# EAGLE design SSR_Board (EAGLE 7.6.0)
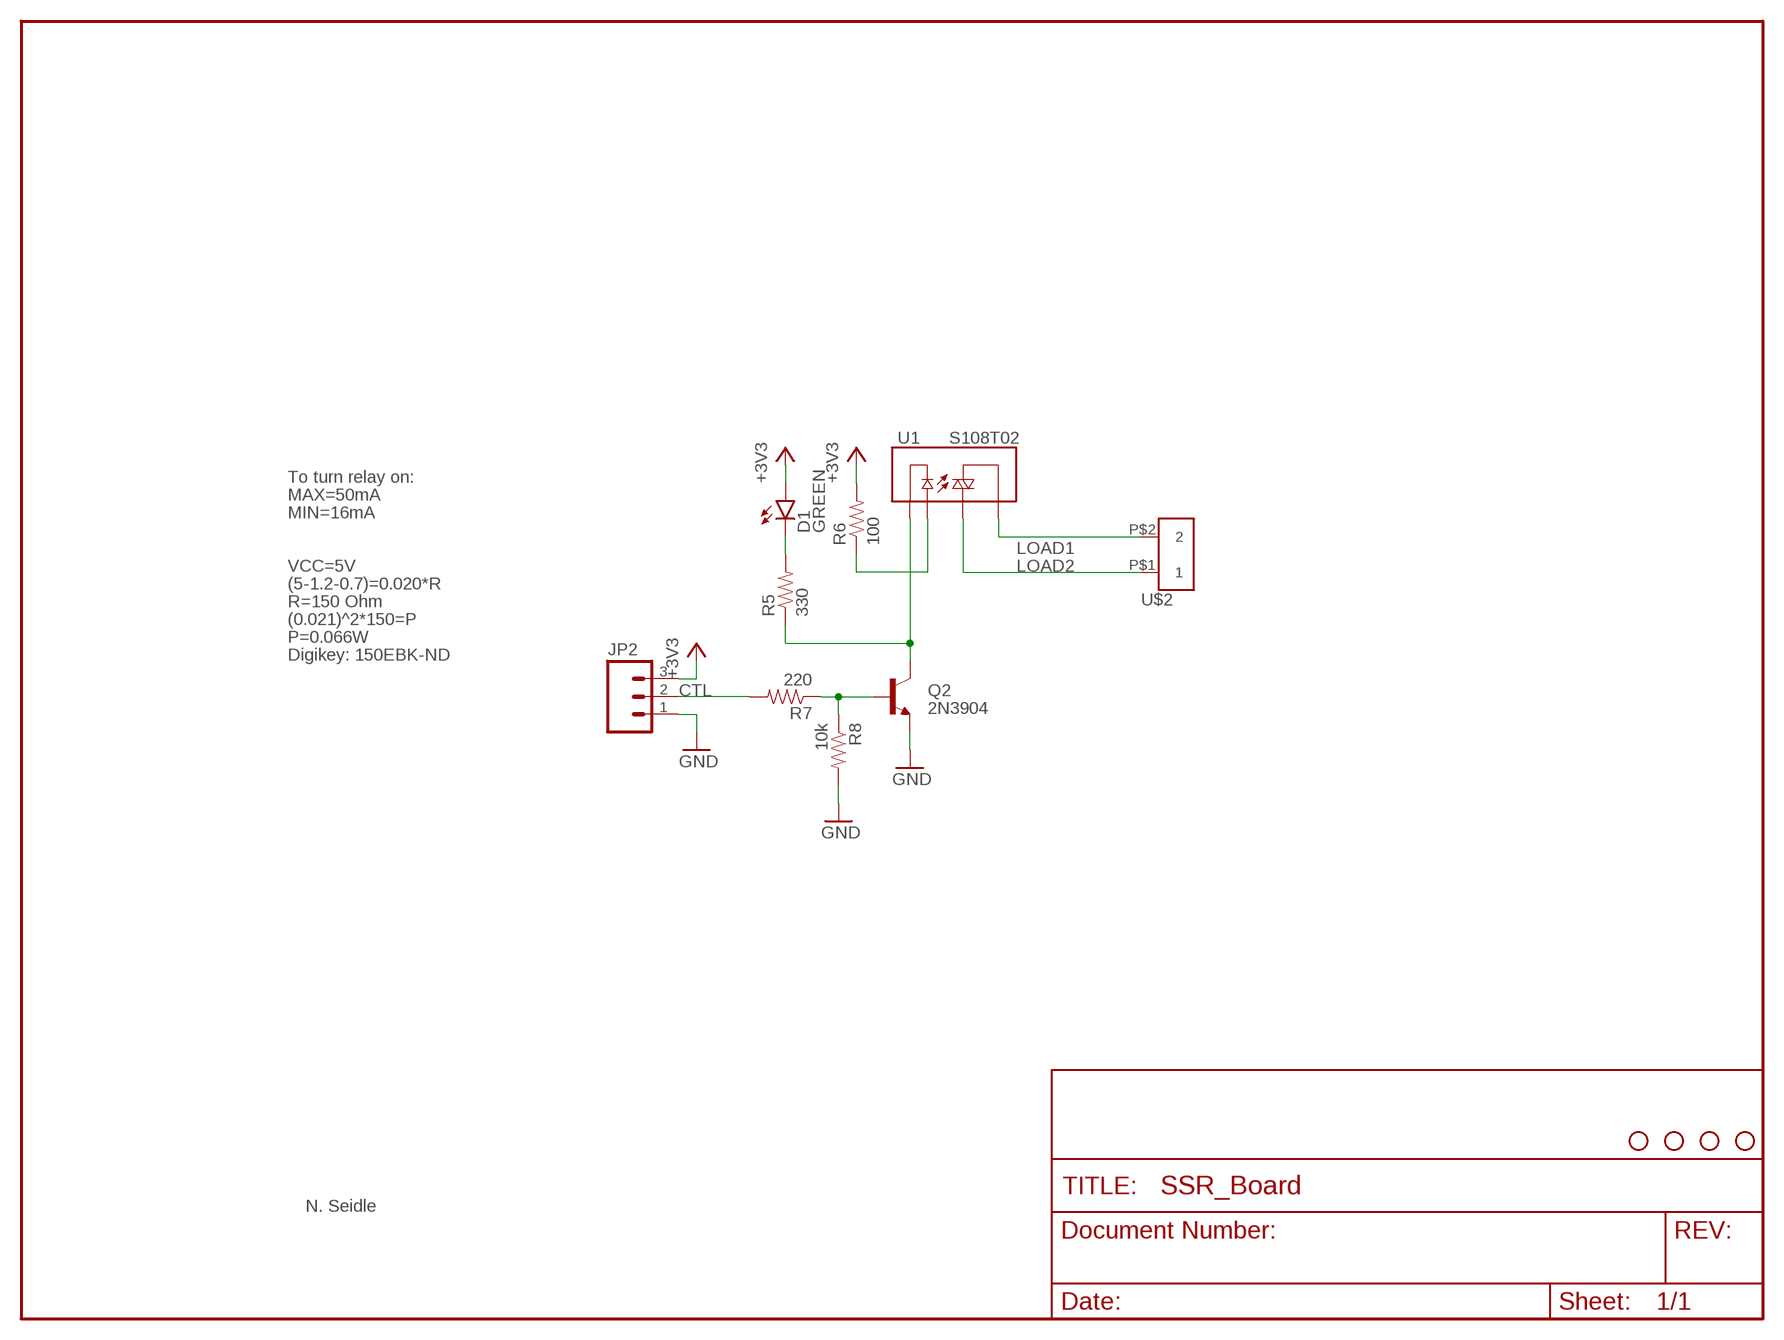
[diagram p0: schematic, sheet 1]

## Parts
D1  GREEN  LED-GREEN0603  [LED-0603]
JP2  M03SCREW  [SCREWTERMINAL-3.5MM-3]
Q2  2N3904  TRANSISTOR_NPNSOT23-3  [SOT23-3]
R5  330  RESISTOR0603-RES  [0603-RES]
R6  100  RESISTOR0603-RES  [0603-RES]
R7  220  RESISTOR0603-RES  [0603-RES]
R8  10k  RESISTOR0603-RES  [0603-RES]
U1  S108T02  RELAY-SOLIDSTATEPTH  [RELAY-S108T02]
U$2  6PCV-02-006  [6PCV-02-006]
U$3  STAND-OFF  [STAND-OFF]
U$4  STAND-OFF  [STAND-OFF]
U$5  STAND-OFF  [STAND-OFF]
U$7  STAND-OFF  [STAND-OFF]

## Nets
+3V3: D1.A JP2.3 R6.2
COIL: Q2.3(C) R5.1 U1.4(-)
CTL: JP2.2 R7.2
GND: JP2.1 Q2.2(E) R8.2
LOAD1: U1.1(T1) U$2.P$2
LOAD2: U1.2(T2) U$2.P$1
N$1: R6.1 U1.3(+)
N$6: Q2.1(B) R7.1 R8.1
N$9: D1.C R5.2

## Notes on the sheet
- To turn relay on:
- MAX=50mA
- MIN=16mA
- VCC=5V
- (5-1.2-0.7)=0.020*R
- R=150 Ohm
- (0.021)^2*150=P
- P=0.066W
- Digikey: 150EBK-ND
- N. Seidle

## Library data of the parts
D1 = SparkFun-LED:LED-GREEN: Various green LEDs Green LEDs used in SFE Production 0603- DIO-00821 LARGE- DIO-00862 LILYPAD- DIO-09910; PROD_ID: DIO-00821
JP2 = SparkFun:M03: Header 3 Standard 3-pin 0.1" header. Use with straight break away headers (SKU : PRT-00116), right angle break away headers (PRT-00553), swiss pins (PRT-00743), machine pins (PRT-00117), and female headers (PRT-00115). Molex polarized connector foot print use with SKU : PRT-08232 with associated crimp pins and housings.
Q2 = SparkFun-DiscreteSemi:TRANSISTOR_NPN: Generic NPN BJT MMBT2222A - TRANS-08049 (SOT-23, 1A 40V) MPSA42 - TRANS-09116 (SOT-23, 500mA 300V) MMBT5088LT1G - TRANS-11160 (SOT-23, 50 mA 30V) BC547 - COM-08928 <http://www.sparkfun.com/products/8928> (TO-92 45V 100mA) (1.Collector 2.Base 3.Emitter) 2N3904 - COM-00521 <http://www.sparkfun.com/products/521> (TO-92 40V 200mA) (1.Emitter 2.Base 3.Collector) P2N2222A - COM-12852 <http://www.sparkfun.com/products/12852> (TO-92 40V 600mA) (1.Collector 2.Base 3.Emitter); PROD_ID: TRANS-08049
R5-R8 = SparkFun-Passives:RESISTOR: Resistor Basic schematic elements and footprints for 0603, 1206, and PTH resistors.
U1 = SparkFun:RELAY-SOLIDSTATE
U$2 = Tim:6PCV-02-006: TE-Connectivity-AMP-Connectors Screw Block Terminal 6PCV-02-006 Digikey part number A98481-ND
U$3-U$5 U$7 = SparkFun:STAND-OFF: Stand Off This is the mechanical footprint for a #4 phillips button head screw. Use the keepout ring to avoid running the screw head into surrounding components. SKU : PRT-00447

## Board
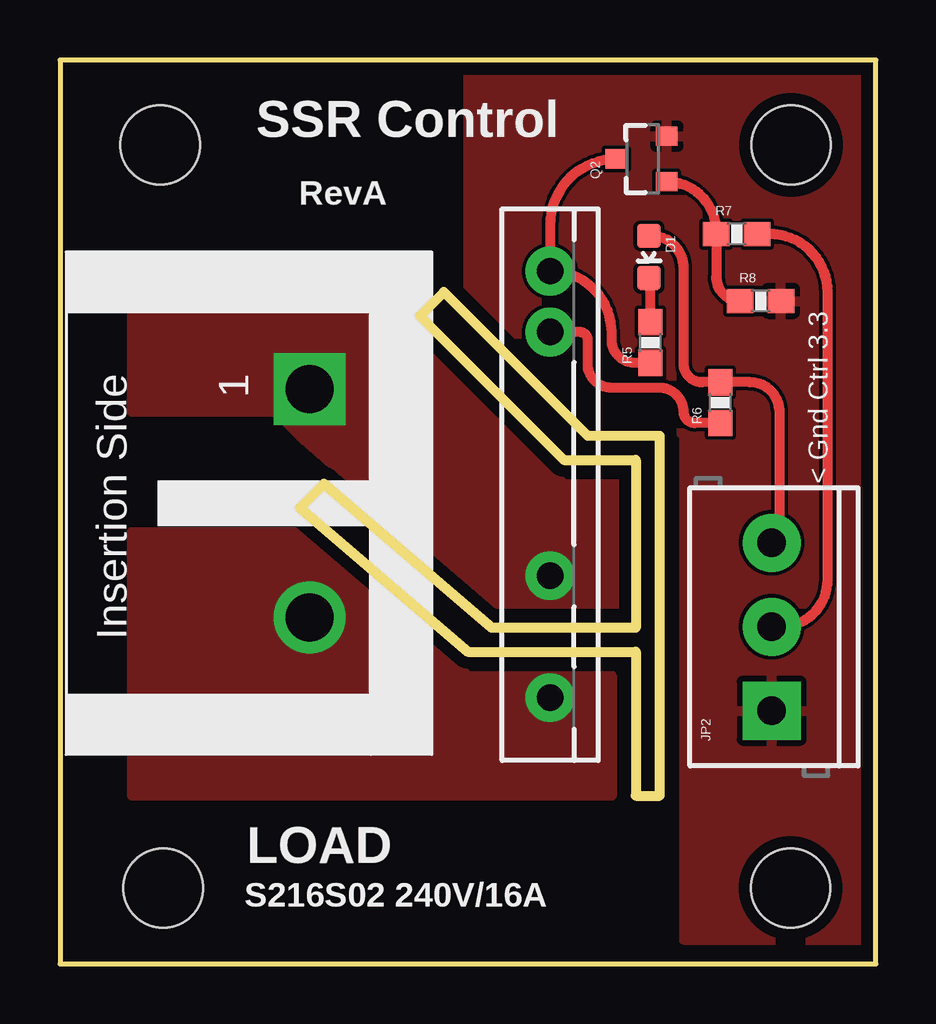
[diagram p1: board, top side]
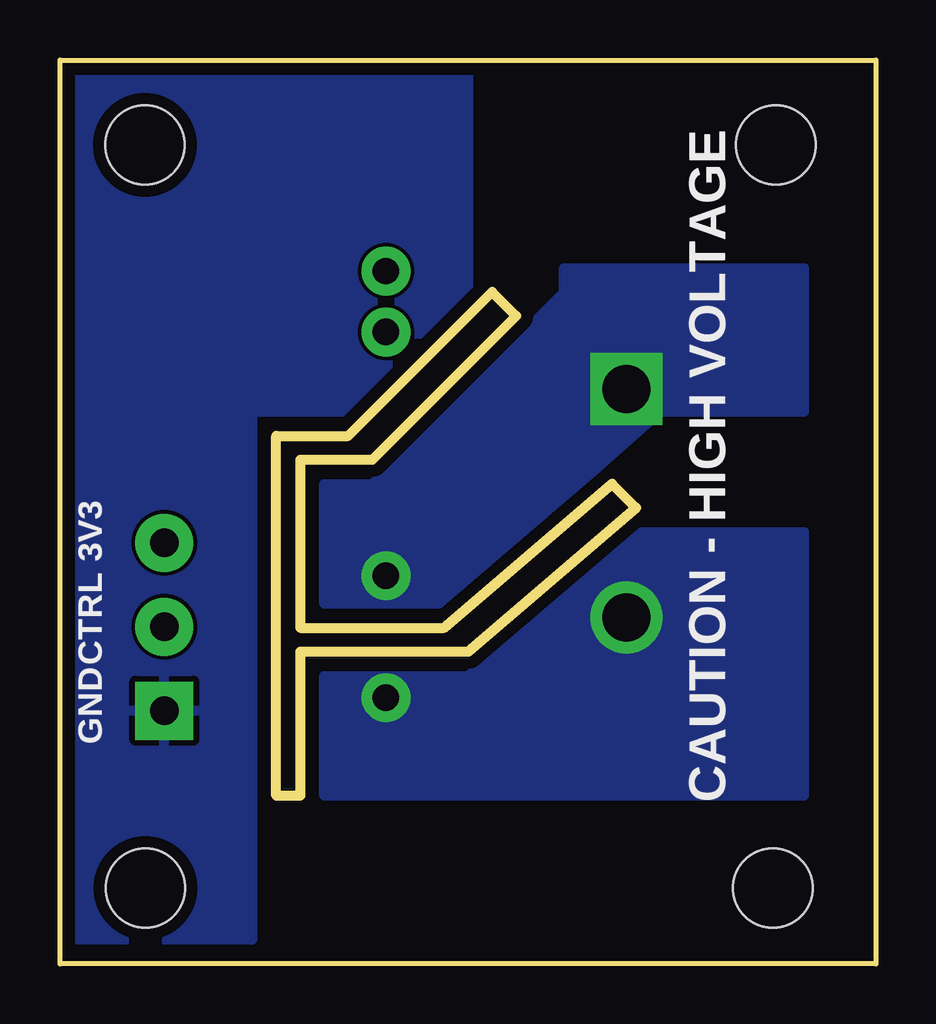
[diagram p2: board, bottom side, seen from below]

Size 34.02 x 37.69 mm. Coordinates in mm from the lower left corner, seen from the top.
Outline: 0,0 34.02,0 34.02,37.69 0,37.69 0,0
Copper layers (1*16): Top 0.0178mm / dielectric 59mil / Bottom 0.0178mm
Design rules "SSC-EAGLE-2Lyr_v1.0.0.3": minimum track width 6mil, minimum drill 14mil, track to track 6mil, track to pad 6mil, pad to pad 6mil, via to via 6mil, smd to smd 6mil, copper to edge 20mil, drill to drill 16mil, minimum pad ring 8mil, minimum via ring 8mil, stop-mask expansion 3mil, vias tented up to drill 0mil, thermal gap 10mil

### Footprints (pad centres in the part's own frame; a part is rotated, then mirrored left to right if it is on the bottom)
LED-0603 = smd 1 x 1: A 0,-0.877; C 0,0.877
SCREWTERMINAL-3.5MM-3 = drill 1.2 pad 2.413 square: 1 0,0 | drill 1.2 pad 2.413: 2 3.5,0; 3 7,0
SOT23-3 = smd 0.8 x 0.9: 1 -0.95,-1; 2 0.95,-1; 3 0,1.1
0603-RES = smd 1.1 x 1: 1 -0.85,0; 2 0.85,0
RELAY-S108T02 = drill 1.1 pad 2.032: 1 -8.88,0; 2 -3.8,0; 3 6.36,0; 4 8.9,0
6PCV-02-006 = drill 2 square: P$1 -5.08,1.905 | drill 2: P$2 4.445,1.905
STAND-OFF = hole 3.302: 0,0

### Placement (x,y rotation side)
D1  24.55,29.47 180 top
JP2  29.67,10.56 90 top
Q2  24.3,33.56 90 top
R5  24.62,25.91 90 top
R6  27.52,23.4 90 top
R7  28.21,30.43 0 top
R8  29.21,27.64 0 top
U1  20.43,19.99 90 top
U$2  8.51,18.89 270 top
U$3  4.3,3.16 0 top
U$4  30.46,3.16 0 top
U$5  30.48,34.15 0 top
U$7  4.17,34.15 0 top

### Tracks (layer width: path | path; a pad name or v marks a point on that pad's centre or on a via)
+3V3
  Top 0.406: JP2.3 arc90 30,17.89 30,23.02 arc90 28.77,24.25 R6.2 26.77,24.25 arc-90 26,25.02 26,29.02 arc90 24.66,30.35 D1.A
COIL
  Top 0.406: Q2.3 arc90 20.43,30.79 U1.4 arc-90 23,26.32 23,26.02 arc90 23.96,25.06 R5.1
CTL
  Top 0.406: JP2.2 30.04,14.06 arc90 32,16.02 32,28.02 arc90 29.59,30.43 R7.2
GND
  pour Bottom: 17,37.02 17,28.02 22,23.02 26,23.02 26,1.02 34,1.02 34,37.02
  pour Top: 17,37.02 17,28.02 22,23.02 25,23.02 26,22.02 26,1.02 34,1.02 34,37.02
LOAD1
  pour Bottom (no thermals): 3,18.02 3,7.02 23,7.02 23,12.02 17,12.02 10,18.02
  pour Top (no thermals): 3,18.02 10,18.02 17,12.02 23,12.02 23,7.02 3,7.02
LOAD2
  pour Top (no thermals): 24,15.02 18,15.02 10,22.02 9,23.02 3,23.02 3,29.02 13,29.02 13,28.02 21,20.02 24,20.02
  pour Bottom (no thermals): 3,29.02 3,23.02 9,23.02 18,15.02 23,15.02 23,20.02 21,20.02 13,28.02 13,29.02
N$1
  Top 0.406: R6.1 26.47,22.55 arc-90 26,23.02 arc90 25,24.02 23,24.02 arc-90 22,25.02 22,26.02 arc90 21.67,26.35 U1.3
N$6
  Top 0.406: Q2.1 arc-90 27.36,30.55 R7.1 27.36,28.64 arc90 R8.1
N$9
  Top 0.406: R5.2 24.62,28.54 arc90 D1.C

### Text on the board
tPlace: SSR Control | RevA | < Gnd Ctrl 3.3 | LOAD | S216S02 240V/16A
bPlace: CAUTION - HIGH VOLTAGE | 3V3 | CTRL | GND